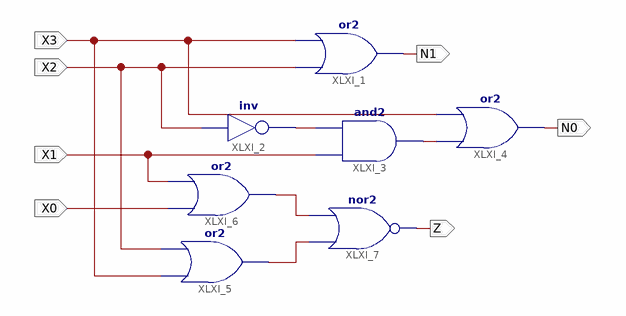
[diagram p0: schematic sheet 1]
// Xilinx ISE schematic HighestIndex.sch (spartan3a) as structural Verilog: 7 symbols, 7 ports
module HighestIndex (
  input  X2,
  input  X1,
  input  X3,
  input  X0,
  output N1,
  output N0,
  output Z
);

  wire XLXN_19, XLXN_22, XLXN_33, XLXN_34;

  or XLXI_1 (N1, X2, X3);
  not XLXI_2 (XLXN_19, X2);
  and XLXI_3 (XLXN_22, X1, XLXN_19);
  or XLXI_4 (N0, XLXN_22, X3);
  or XLXI_5 (XLXN_34, X3, X2);
  or XLXI_6 (XLXN_33, X0, X1);
  nor XLXI_7 (Z, XLXN_34, XLXN_33);
endmodule
